# EAGLE schematic tl100-4-driver_sch-pcb (EAGLE 9.5.1)

## Sheet 1 of 4: CONTROL
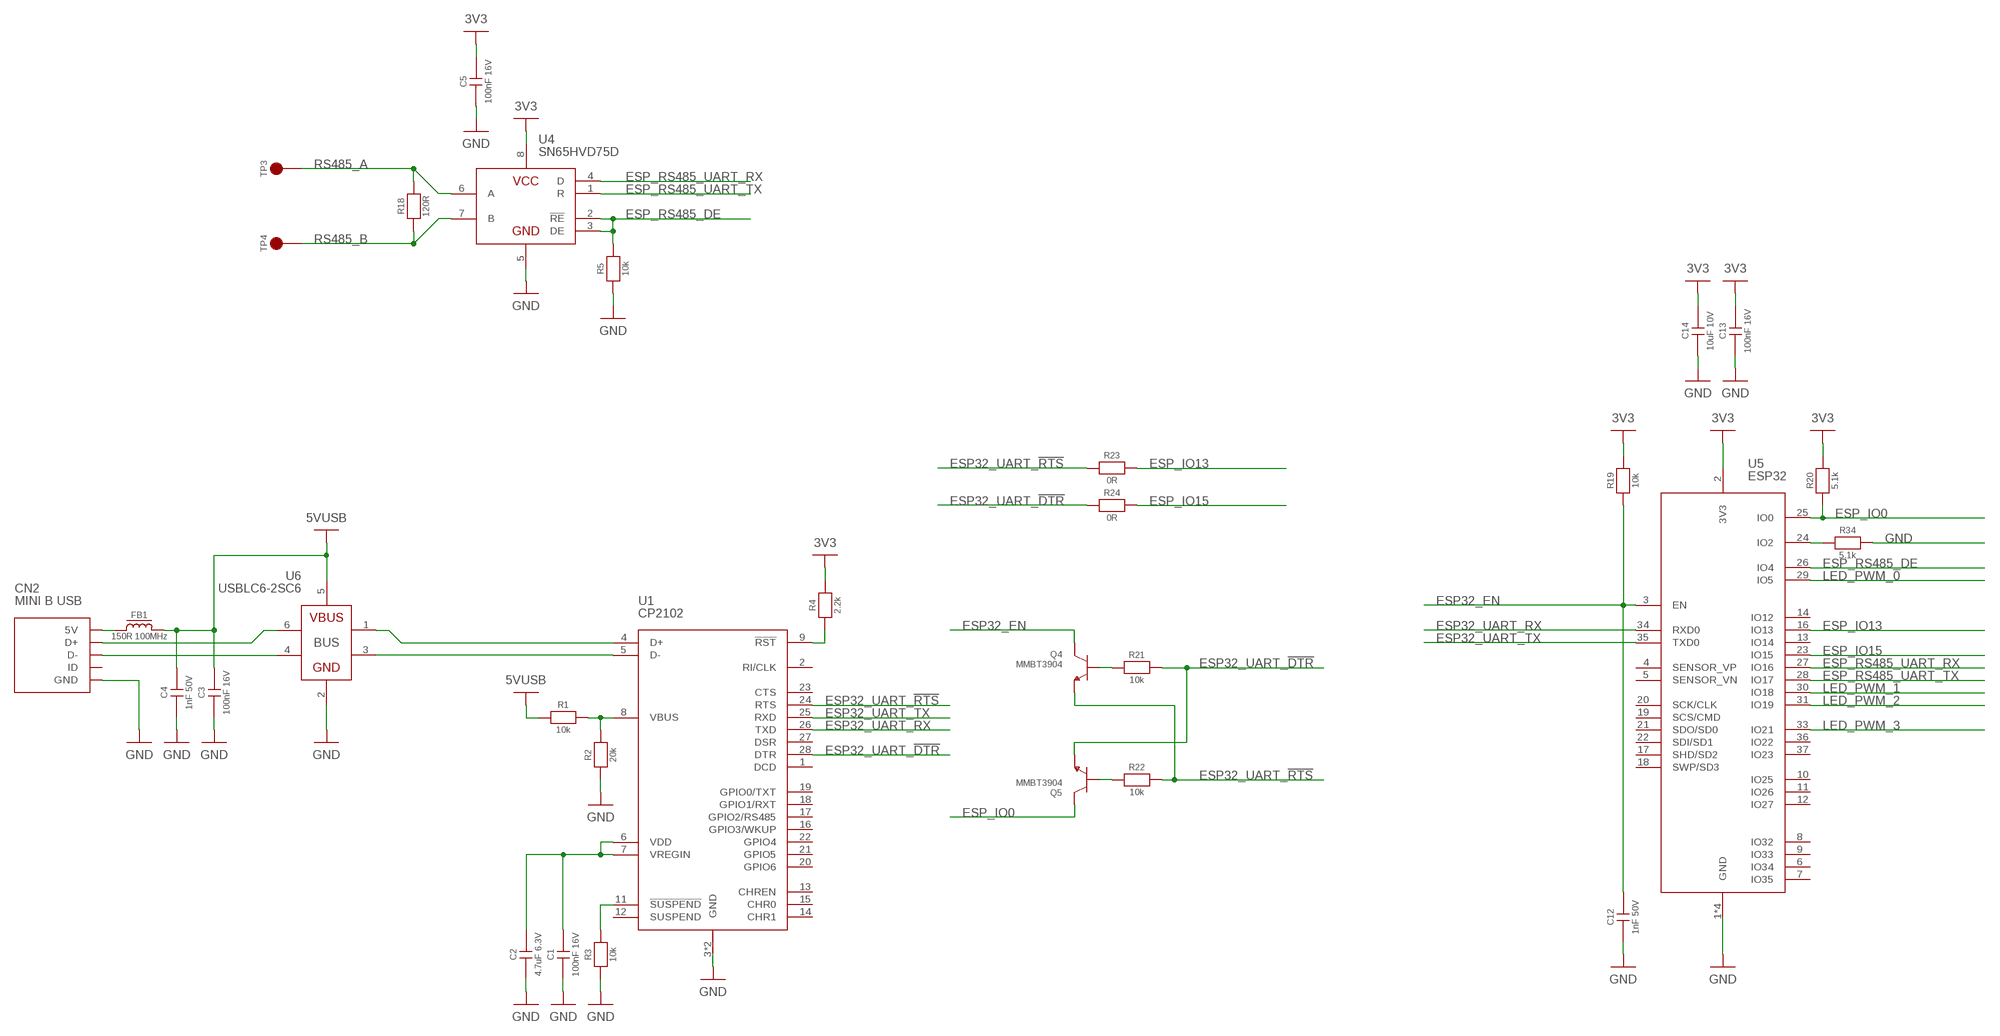
[diagram p0: schematic, sheet 1]

### Parts
C1  100nF 16V  CL10B104KO8WPNC  [0603]
C2  4.7uF 6.3V  GRM188R60J475ME19D  [0603]
C3  100nF 16V  CL10B104KO8WPNC  [0603]
C4  1nF 50V  CL10B102KB8NNNC  [0603]
C5  100nF 16V  CL10B104KO8WPNC  [0603]
C12  1nF 50V  CL10B102KB8NNNC  [0603]
C13  100nF 16V  CL10B104KO8WPNC  [0603]
C14  10uF 10V  GRM188R61A106KE69D  [0603]
CN2  MINI B USB  MUSB-05-S-B-SM-A  [MUSB-05-S-B-SM-A]
FB1  150R 100MHz  ILB1206ER151V  [1206]
Q4  MMBT3904  MMBT3904-7-F  [SOT23-3]
Q5  MMBT3904  MMBT3904-7-F  [SOT23-3]
R1  10k  ERJ3EKF1002V  [0603]
R2  20k  ERJ3EKF2002V  [0603]
R3  10k  ERJ3EKF1002V  [0603]
R4  2.2k  ERJ3EKF2201V  [0603]
R5  10k  ERJ3EKF1002V  [0603]
R18  120R  ERJ3EKF1200V  [0603]
R19  10k  ERJ3EKF1002V  [0603]
R20  5.1k  ERJ3EKF5101V  [0603]
R21  10k  ERJ3EKF1002V  [0603]
R22  10k  ERJ3EKF1002V  [0603]
R23  0R  CRCW06030000Z0EA  [0603]
R24  0R  CRCW06030000Z0EA  [0603]
R34  5.1k  ERJ3EKF5101V  [0603]
TP3  2MM_TEST_POINT  [2MM_TEST_PAD]
TP4  2MM_TEST_POINT  [2MM_TEST_PAD]
U1  CP2102  CP2102N-A01-GQFN28  [QFN28]
U4  SN65HVD75D  [SO8]
U5  ESP32  ESP32-WROOM-32D  [ESP32-WROOM-32D]
U6  USBLC6-2SC6  [SOT23-6]

### Nets
3V3: C5.2 C13.2 C14.2 R4.2 R19.2 R20.2 U4.8(VCC) U5.2(3V3) ; also sheet 3
5VUSB: C3.2 C4.2 FB1.2 R1.1 U6.5(VBUS) ; also sheet 3
ESP32_EN: C12.2 Q4.2(C) R19.1 U5.3(EN)
ESP32_UART_!DTR: Q5.3(E) R21.2 R24.1 U1.28(DTR)
ESP32_UART_!RTS: Q4.3(E) R22.2 R23.1 U1.24(RTS)
ESP32_UART_RX: U1.26(TXD) U5.34(RXD0)
ESP32_UART_TX: U1.25(RXD) U5.35(TXD0)
ESP_IO0: Q5.2(C) R20.1 U5.25(IO0)
ESP_IO13: R23.2 U5.16(IO13)
ESP_IO15: R24.2 U5.23(IO15)
ESP_RS485_DE: R5.2 U4.2(!RE) U4.3(DE) U5.26(IO4)
ESP_RS485_UART_RX: U4.4(D) U5.27(IO16)
ESP_RS485_UART_TX: U4.1(R) U5.28(IO17)
GND: C1.1 C2.1 C3.1 C4.1 C5.1 C12.1 C13.1 C14.1 CN2.GND CN2.SHIELD1(GND) CN2.SHIELD2(GND) CN2.SHIELD3(GND) CN2.SHIELD4(GND) R2.1 R3.1 R5.1 R34.2 U1.3(GND) U1.29(GND) U4.5(GND) U5.1(GND) U5.15(GND) U5.38(GND) U5.39(GND) U6.2(GND) ; also sheet 2,3
LED_PWM_0: U5.29(IO5) ; also sheet 2
LED_PWM_1: U5.30(IO18) ; also sheet 2
LED_PWM_2: U5.31(IO19) ; also sheet 2
LED_PWM_3: U5.33(IO21) ; also sheet 2
N$1: R1.2 R2.2 U1.8(VBUS)
N$2: R4.1 U1.9(!RST)
N$3: R3.2 U1.11(!SUSPEND)
N$7: C1.2 C2.2 U1.6(VDD) U1.7(VREGIN)
N$13: R34.1 U5.24(IO2)
N$20: CN2.VCC(5V) FB1.1
N$95: CN2.D- U6.4(D-OUT)
N$96: CN2.D+ U6.6(D+_OUT)
N$97: U1.5(D-) U6.3(D-_IN)
N$98: U1.4(D+) U6.1(D+_IN)
N$99: Q4.1(B) R21.1
N$100: Q5.1(B) R22.1
RS485_A: R18.2 TP3.1 U4.6(A)
RS485_B: R18.1 TP4.1 U4.7(B)
Unconnected: CN2.ID U1.1(DCD) U1.2(RI/CLK) U1.12(SUSPEND) U1.13(CHREN) U1.14(CHR1) U1.15(CHR0) U1.16(GPIO3/WKUP) U1.17(GPIO2/RS485) U1.18(GPIO1/RXT) U1.19(GPIO0/TXT) U1.20(GPIO6) U1.21(GPIO5) U1.22(GPIO4) U1.23(CTS) U1.27(DSR) U5.4(SENSOR_VP) U5.5(SENSOR_VN) U5.6(IO34) U5.7(IO35) U5.8(IO32) U5.9(IO33) U5.10(IO25) U5.11(IO26) U5.12(IO27) U5.13(IO14) U5.14(IO12) U5.17(SHD/SD2) U5.18(SWP/SD3) U5.19(SCS/CMD) U5.20(SCK/CLK) U5.21(SDO/SD0) U5.22(SDI/SD1) U5.36(IO22) U5.37(IO23)

## Sheet 2 of 4: LEDS
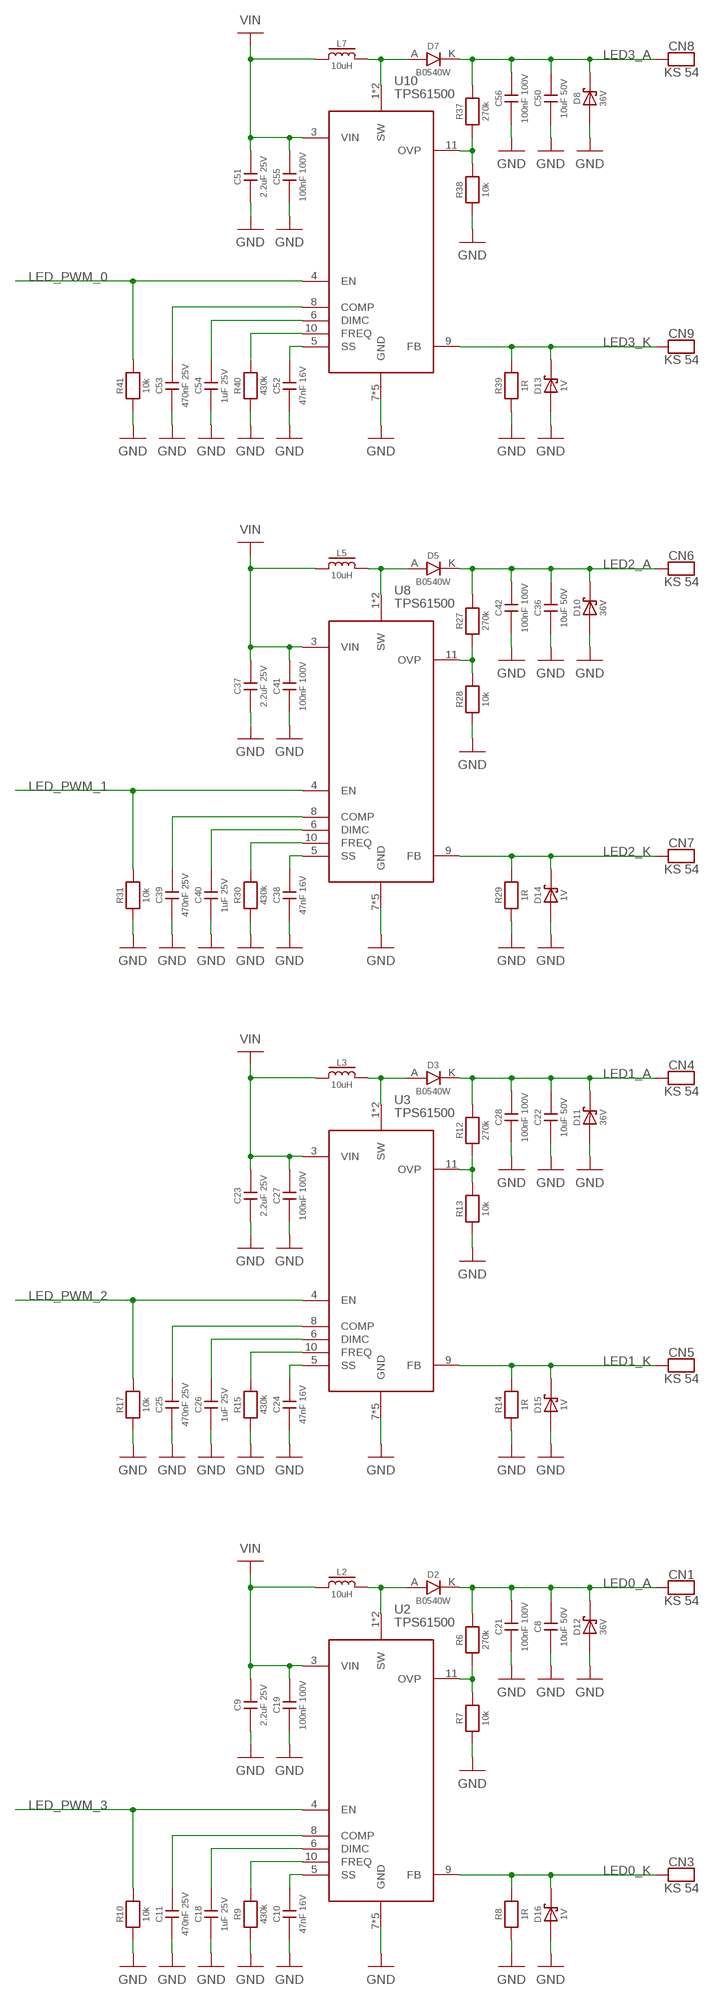
[diagram p1: schematic, sheet 2]

### Parts
C8  10uF 50V  C3225X7S1H106M250AB  [1210]
C9  2.2uF 25V  GRM188R61E225KA12D  [0603]
C10  47nF 16V  CL10B473KO8NNNC  [0603]
C11  470nF 25V  GRM188R71E474KA12D  [0603]
C18  1uF 25V  CL10A105KA8NNNC  [0603]
C19  100nF 100V  06031C104KAT2A  [0603]
C21  100nF 100V  06031C104KAT2A  [0603]
C22  10uF 50V  C3225X7S1H106M250AB  [1210]
C23  2.2uF 25V  GRM188R61E225KA12D  [0603]
C24  47nF 16V  CL10B473KO8NNNC  [0603]
C25  470nF 25V  GRM188R71E474KA12D  [0603]
C26  1uF 25V  CL10A105KA8NNNC  [0603]
C27  100nF 100V  06031C104KAT2A  [0603]
C28  100nF 100V  06031C104KAT2A  [0603]
C36  10uF 50V  C3225X7S1H106M250AB  [1210]
C37  2.2uF 25V  GRM188R61E225KA12D  [0603]
C38  47nF 16V  CL10B473KO8NNNC  [0603]
C39  470nF 25V  GRM188R71E474KA12D  [0603]
C40  1uF 25V  CL10A105KA8NNNC  [0603]
C41  100nF 100V  06031C104KAT2A  [0603]
C42  100nF 100V  06031C104KAT2A  [0603]
C50  10uF 50V  C3225X7S1H106M250AB  [1210]
C51  2.2uF 25V  GRM188R61E225KA12D  [0603]
C52  47nF 16V  CL10B473KO8NNNC  [0603]
C53  470nF 25V  GRM188R71E474KA12D  [0603]
C54  1uF 25V  CL10A105KA8NNNC  [0603]
C55  100nF 100V  06031C104KAT2A  [0603]
C56  100nF 100V  06031C104KAT2A  [0603]
CN1  KS 54  KEYSTONE_54  [KEYSTONE_54]
CN3  KS 54  KEYSTONE_54  [KEYSTONE_54]
CN4  KS 54  KEYSTONE_54  [KEYSTONE_54]
CN5  KS 54  KEYSTONE_54  [KEYSTONE_54]
CN6  KS 54  KEYSTONE_54  [KEYSTONE_54]
CN7  KS 54  KEYSTONE_54  [KEYSTONE_54]
CN8  KS 54  KEYSTONE_54  [KEYSTONE_54]
CN9  KS 54  KEYSTONE_54  [KEYSTONE_54]
D2  B0540W  [SOD-123]
D3  B0540W  [SOD-123]
D5  B0540W  [SOD-123]
D7  B0540W  [SOD-123]
D8  36V  GSOT36-HE3-08  [SOT23-3]
D10  36V  GSOT36-HE3-08  [SOT23-3]
D11  36V  GSOT36-HE3-08  [SOT23-3]
D12  36V  GSOT36-HE3-08  [SOT23-3]
D13  1V  VESD01C1-02VHG3-08  [SC-79]
D14  1V  VESD01C1-02VHG3-08  [SC-79]
D15  1V  VESD01C1-02VHG3-08  [SC-79]
D16  1V  VESD01C1-02VHG3-08  [SC-79]
L2  10uH  SRN6045-100M  [SRN6045]
L3  10uH  SRN6045-100M  [SRN6045]
L5  10uH  SRN6045-100M  [SRN6045]
L7  10uH  SRN6045-100M  [SRN6045]
R6  270k  ERJ3EKF2703V  [0603]
R7  10k  ERJ3EKF1002V  [0603]
R8  1R  CRCW12061R00FKEA  [1206]
R9  430k  ERJ3EKF4303V  [0603]
R10  10k  ERJ3EKF1002V  [0603]
R12  270k  ERJ3EKF2703V  [0603]
R13  10k  ERJ3EKF1002V  [0603]
R14  1R  CRCW12061R00FKEA  [1206]
R15  430k  ERJ3EKF4303V  [0603]
R17  10k  ERJ3EKF1002V  [0603]
R27  270k  ERJ3EKF2703V  [0603]
R28  10k  ERJ3EKF1002V  [0603]
R29  1R  CRCW12061R00FKEA  [1206]
R30  430k  ERJ3EKF4303V  [0603]
R31  10k  ERJ3EKF1002V  [0603]
R37  270k  ERJ3EKF2703V  [0603]
R38  10k  ERJ3EKF1002V  [0603]
R39  1R  CRCW12061R00FKEA  [1206]
R40  430k  ERJ3EKF4303V  [0603]
R41  10k  ERJ3EKF1002V  [0603]
U2  TPS61500  [HTSSOP14-4.5]
U3  TPS61500  [HTSSOP14-4.5]
U8  TPS61500  [HTSSOP14-4.5]
U10  TPS61500  [HTSSOP14-4.5]

### Nets
GND: C8.1 C9.1 C10.1 C11.1 C18.1 C19.1 C21.1 C22.1 C23.1 C24.1 C25.1 C26.1 C27.1 C28.1 C36.1 C37.1 C38.1 C39.1 C40.1 C41.1 C42.1 C50.1 C51.1 C52.1 C53.1 C54.1 C55.1 C56.1 D8.1(A) D10.1(A) D11.1(A) D12.1(A) D13.A D14.A D15.A D16.A R7.1 R8.1 R9.1 R10.1 R13.1 R14.1 R15.1 R17.1 R28.1 R29.1 R30.1 R31.1 R38.1 R39.1 R40.1 R41.1 U2.7(GND) U2.12(GND) U2.13(GND) U2.14(GND) U2.PAD(GND) U3.7(GND) U3.12(GND) U3.13(GND) U3.14(GND) U3.PAD(GND) U8.7(GND) U8.12(GND) U8.13(GND) U8.14(GND) U8.PAD(GND) U10.7(GND) U10.12(GND) U10.13(GND) U10.14(GND) U10.PAD(GND) ; also sheet 1,3
LED0_A: C8.2 C21.2 CN1.P$1 CN1.P$2 CN1.P$3 D2.K D12.2(K) R6.2
LED0_K: CN3.P$1 CN3.P$2 CN3.P$3 D16.K R8.2 U2.9(FB)
LED1_A: C22.2 C28.2 CN4.P$1 CN4.P$2 CN4.P$3 D3.K D11.2(K) R12.2
LED1_K: CN5.P$1 CN5.P$2 CN5.P$3 D15.K R14.2 U3.9(FB)
LED2_A: C36.2 C42.2 CN6.P$1 CN6.P$2 CN6.P$3 D5.K D10.2(K) R27.2
LED2_K: CN7.P$1 CN7.P$2 CN7.P$3 D14.K R29.2 U8.9(FB)
LED3_A: C50.2 C56.2 CN8.P$1 CN8.P$2 CN8.P$3 D7.K D8.2(K) R37.2
LED3_K: CN9.P$1 CN9.P$2 CN9.P$3 D13.K R39.2 U10.9(FB)
LED_PWM_0: R41.2 U10.4(EN) ; also sheet 1
LED_PWM_1: R31.2 U8.4(EN) ; also sheet 1
LED_PWM_2: R17.2 U3.4(EN) ; also sheet 1
LED_PWM_3: R10.2 U2.4(EN) ; also sheet 1
N$6: C10.2 U2.5(SS)
N$8: R9.2 U2.10(FREQ)
N$9: C18.2 U2.6(DIMC)
N$10: C11.2 U2.8(COMP)
N$11: R6.1 R7.2 U2.11(OVP)
N$12: D2.A L2.2 U2.1(SW) U2.2(SW)
N$14: C24.2 U3.5(SS)
N$15: R15.2 U3.10(FREQ)
N$16: C26.2 U3.6(DIMC)
N$17: C25.2 U3.8(COMP)
N$18: R12.1 R13.2 U3.11(OVP)
N$19: D3.A L3.2 U3.1(SW) U3.2(SW)
N$26: C38.2 U8.5(SS)
N$27: R30.2 U8.10(FREQ)
N$28: C40.2 U8.6(DIMC)
N$29: C39.2 U8.8(COMP)
N$30: R27.1 R28.2 U8.11(OVP)
N$31: D5.A L5.2 U8.1(SW) U8.2(SW)
N$38: C52.2 U10.5(SS)
N$39: R40.2 U10.10(FREQ)
N$40: C54.2 U10.6(DIMC)
N$41: C53.2 U10.8(COMP)
N$42: R37.1 R38.2 U10.11(OVP)
N$43: D7.A L7.2 U10.1(SW) U10.2(SW)
VIN: C9.2 C19.2 C23.2 C27.2 C37.2 C41.2 C51.2 C55.2 L2.1 L3.1 L5.1 L7.1 U2.3(VIN) U3.3(VIN) U8.3(VIN) U10.3(VIN) ; also sheet 3

## Sheet 3 of 4: PSU
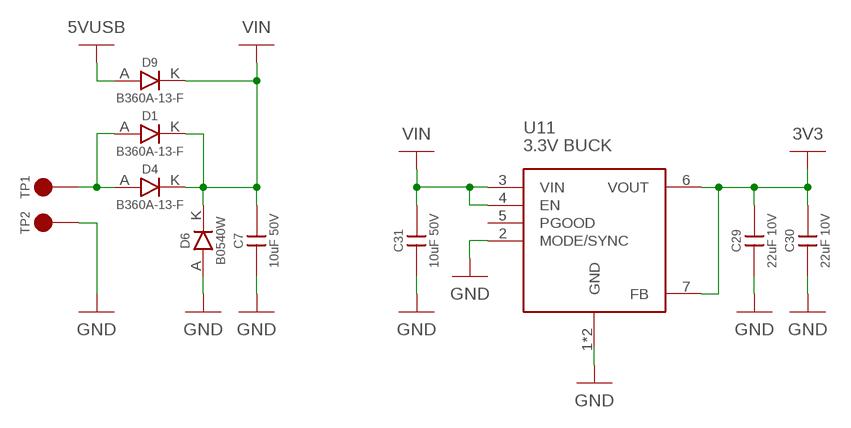
[diagram p2: schematic, sheet 3]

### Parts
C7  10uF 50V  C3225X7S1H106M250AB  [1210]
C29  22uF 10V  CL31B226MPHNNNE  [1206]
C30  22uF 10V  CL31B226MPHNNNE  [1206]
C31  10uF 50V  C3225X7S1H106M250AB  [1210]
D1  B360A-13-F  [DO214AC]
D4  B360A-13-F  [DO214AC]
D6  B0540W  [SOD-123]
D9  B360A-13-F  [DO214AC]
TP1  2MM_TEST_POINT  [2MM_TEST_PAD]
TP2  2MM_TEST_POINT  [2MM_TEST_PAD]
U11  3.3V BUCK  LMZM23600V3SILT  [TI_MICROSIP_10]

### Nets
3V3: C29.2 C30.2 U11.6(VOUT) U11.7(FB) ; also sheet 1
5VUSB: D9.A ; also sheet 1
GND: C7.1 C29.1 C30.1 C31.1 D6.A TP2.1 U11.1(GND) U11.2(MODE/SYNC) U11.PAD(GND) ; also sheet 1,2
N$5: D1.A D4.A TP1.1
VIN: C7.2 C31.2 D1.K D4.K D6.K D9.K U11.3(VIN) U11.4(EN) ; also sheet 2
Unconnected: U11.5(PGOOD)

## Sheet 4 of 4
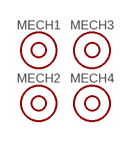
[diagram p3: schematic, sheet 4]

### Parts
MECH1  6mm x 3mm  MOUNTHOLE  [MOUNTHOLE_6X3]
MECH2  6mm x 3mm  MOUNTHOLE  [MOUNTHOLE_6X3]
MECH3  6mm x 3mm  MOUNTHOLE  [MOUNTHOLE_6X3]
MECH4  6mm x 3mm  MOUNTHOLE  [MOUNTHOLE_6X3]

## Library data of the parts
C1 C3 C5 C13 = CAPACITORS:CL10B104KO8WPNC: 100nF 16V X7R 10% 0603 MLCC; DIGIKEY: 1276-6582-1-ND; HEIGHT: 1; PRICE_PER: 0.08
C2 = CAPACITORS:GRM188R60J475ME19D: 4.7uF 6.3V X5R 10% 0603 MLCC.; FARNELL: 2362095; HEIGHT: 1; PRICE_PER: 0.0414
C4 C12 = CAPACITORS:CL10B102KB8NNNC: 1nF 50V X7R 10% 0603 MLCC.; DIGIKEY: 1276-1018-1-ND; HEIGHT: 1; PRICE_PER: 0.08
C7 C8 C22 C31 C36 C50 = CAPACITORS:C3225X7S1H106M250AB: 10uF 50V X7S 20% 1210 MLCC.; DIGIKEY: 445-4537-1-ND; HEIGHT: 3; PRICE_PER: 0.583
C9 C23 C37 C51 = CAPACITORS:GRM188R61E225KA12D: 2.2uF 25V X5R 10% 0603 MLCC.; DIGIKEY: 490-10731-1-ND; HEIGHT: 1; PRICE_PER: 0.14
C10 C24 C38 C52 = CAPACITORS:CL10B473KO8NNNC: 47nF 16V X7R 10% 0603 MLCC.; DIGIKEY: 1276-2079-1-ND; HEIGHT: 1; PRICE_PER: 0.08
C11 C25 C39 C53 = CAPACITORS:GRM188R71E474KA12D: 470nF 25V X7R 10% 0603 MLCC.; DIGIKEY: 490-3291-1-ND; HEIGHT: 1; PRICE_PER: 0.2
C14 = CAPACITORS:GRM188R61A106KE69D: 10uF 10V X5R 10% 0603 MLCC.; DIGIKEY: 490-10474-1-ND; HEIGHT: 0.95; PRICE_PER: 0.17
C18 C26 C40 C54 = CAPACITORS:CL10A105KA8NNNC: 1uF 25V X5R 10% 0603 MLCC.; DIGIKEY: 1276-1102-1-ND; HEIGHT: 1; PRICE_PER: 0.08
C19 C21 C27 C28 C41 C42 C55 C56 = CAPACITORS:06031C104KAT2A: 100nF 100V X7R 10% 0603 MLCC.; DIGIKEY: 478-10047-1-ND; HEIGHT: 1; PRICE_PER: 0.14
C29 C30 = CAPACITORS:CL31B226MPHNNNE: 22uF 10V X7R 10% 1206 MLCC.; DIGIKEY: 1276-3148-6-ND; HEIGHT: 1.8; PRICE_PER: 0.47
CN1 CN3-CN9 = CONNECTORs:KEYSTONE_54: Battery Contact Clip 18650 1 Cell PC Pin; DIGIKEY: 36-54-ND; HEIGHT: 17; PRICE_PER: 0.46
CN2 = CONNECTORs:MUSB-05-S-B-SM-A: 5 pin, SMD, mini USB connector.; DIGIKEY: SAM8841-ND; HEIGHT: 4; PRICE_PER: 1.11
D1 D4 D9 = DIODES:B360A-13-F: Schottky Rectifier, 60 V, 3 A, Single, DO-214AC, 2 Pins, 700 mV; DIGIKEY: B360A-FDICT-ND; HEIGHT: 2; PRICE_PER: 0.31
D2 D3 D5-D7 = DIODES:B0540W: 410mW, Low VF SMD Schottky Barrier Diode; DIGIKEY: B0540W-FDICT-ND; HEIGHT: 1; PRICE_PER: 0.153
D8 D10-D12 = DIODES:GSOT36-HE3-08: 71V Clamp 3.5A (8/20µs) Ipp Tvs Diode Surface Mount SOT-23; DIGIKEY: GSOT36-HE3-08GICT-ND; HEIGHT: 1; PRICE_PER: 0.3
D13-D16 = DIODES:VESD01C1-02VHG3-08: 6.9V Clamp 14.6A (8/20µs) Ipp Tvs Diode Surface Mount SOD-523; DIGIKEY: VESD01C1-02VHG3-08GICT-ND; HEIGHT: 1; PRICE_PER: 0.3
FB1 = INDUCTORS:ILB1206ER151V: Ferrite bead, 100MHz, 150R, 0.8A, 1206; DIGIKEY: 541-2281-1-ND; HEIGHT: 1.5; PRICE_PER: 0.14
L2 L3 L5 L7 = INDUCTORS:SRN6045-100M: BOURNS SRN6045-100M Surface Mount Power Inductor, SRN6045 Series, 10 µH, 2.5 A, 3 A, Shielded, 0.0586 ohm; DIGIKEY: SRN6045-100MCT-ND; HEIGHT: 5; PRICE_PER: 0.45
MECH1-MECH4 = MISC:MOUNTHOLE: Mechanical mounting hole.
Q4 Q5 = TRANSISTORs:MMBT3904-7-F: Bipolar (BJT) Transistor NPN 40V 200mA 300MHz 300mW Surface Mount SOT-23-3; DIGIKEY: MMBT3904-FDICT-ND; HEIGHT: 0.8; PRICE_PER: 0.1
R1 R3 R5 R7 R10 R13 R17 R19 R21 R22 R28 R31 R38 R41 = r_0603:ERJ3EKF1002V: 10000 10k 0603 0.1W 1% thick film resistor.; DIGIKEY: P10.0KHCT-ND; PRICE_PER: 0.10000
R2 = r_0603:ERJ3EKF2002V: 20000 20k 0603 0.1W 1% thick film resistor.; DIGIKEY: P20.0KHCT-ND; PRICE_PER: 0.10000
R4 = r_0603:ERJ3EKF2201V: 2200 2.2k 0603 0.1W 1% thick film resistor.; DIGIKEY: P2.20KHCT-ND; PRICE_PER: 0.10000
R6 R12 R27 R37 = r_0603:ERJ3EKF2703V: 270000 270k 0603 0.1W 1% thick film resistor.; DIGIKEY: P270KHCT-ND; PRICE_PER: 0.10000
R8 R14 R29 R39 = RESISTORS:CRCW12061R00FKEA: 1 1R0 1206 0.25W 1% thick film resistor.; DIGIKEY: 541-1.00FFCT-ND; HEIGHT: 0.65; PRICE_PER: 0.08
R9 R15 R30 R40 = r_0603:ERJ3EKF4303V: 430000 430k 0603 0.1W 1% thick film resistor.; DIGIKEY: P430KHCT-ND; PRICE_PER: 0.10000
R18 = r_0603:ERJ3EKF1200V: 120 120R 0603 0.1W 1% thick film resistor.; DIGIKEY: P120HCT-ND; PRICE_PER: 0.10000
R20 R34 = r_0603:ERJ3EKF5101V: 5100 5.1k 0603 0.1W 1% thick film resistor.; DIGIKEY: P5.10KHCT-ND; PRICE_PER: 0.10000
R23 R24 = RESISTORS:CRCW06030000Z0EA: 0 0R 0603 0.1W thick film resistor; DIGIKEY: 541-0.0GCT-ND; HEIGHT: 0.5; PRICE_PER: 0.08
TP1-TP4 = MISC:2MM_TEST_POINT: A 2MM round pad for test purposes.
U1 = ICs:CP2102N-A01-GQFN28: USB Bridge, USB to UART USB 2.0 UART Interface 28-QFN (5x5); DIGIKEY: 336-3694-ND; HEIGHT: 1.2; PRICE_PER: 1.09
U2 U3 U8 U10 = ICs:TPS61500: TPS61500 High-Brightness, LED Driver With Integrated 3-A, 40-V Power Switch; DIGIKEY: 296-24014-1-ND; HEIGHT: 1; PRICE_PER: 1.95
U4 = ICs:SN65HVD75D: 3.3-V Supply RS-485 With IEC ESD protection; DIGIKEY: 296-38570-1-ND; HEIGHT: 1.8; PRICE_PER: 2.09
U5 = ICs:ESP32-WROOM-32D: Bluetooth, WiFi 802.11b/g/n, Bluetooth v4.2 + EDR, Class 1, 2 and 3 Transceiver Module 2.4GHz ~ 2.5GHz Integrated, Trace Surface Mount; DIGIKEY: 1904-1023-1-ND; HEIGHT: 5; PRICE_PER: 3.01
U6 = ICs:USBLC6-2SC6: Very low capacitance ESD protection; DIGIKEY: 497-5235-1-ND; HEIGHT: 1.5; PRICE_PER: 0.38
U11 = ICs:LMZM23600V3SILT: 36-V, 0.5-A Step-Down DC/DC Power Module in 3.8-mm × 3-mm Package; DIGIKEY: 296-49458-1-ND; HEIGHT: 1.6; PRICE_PER: 4.24